# Altium project Breathalyzer_80_Interface.PrjPcb
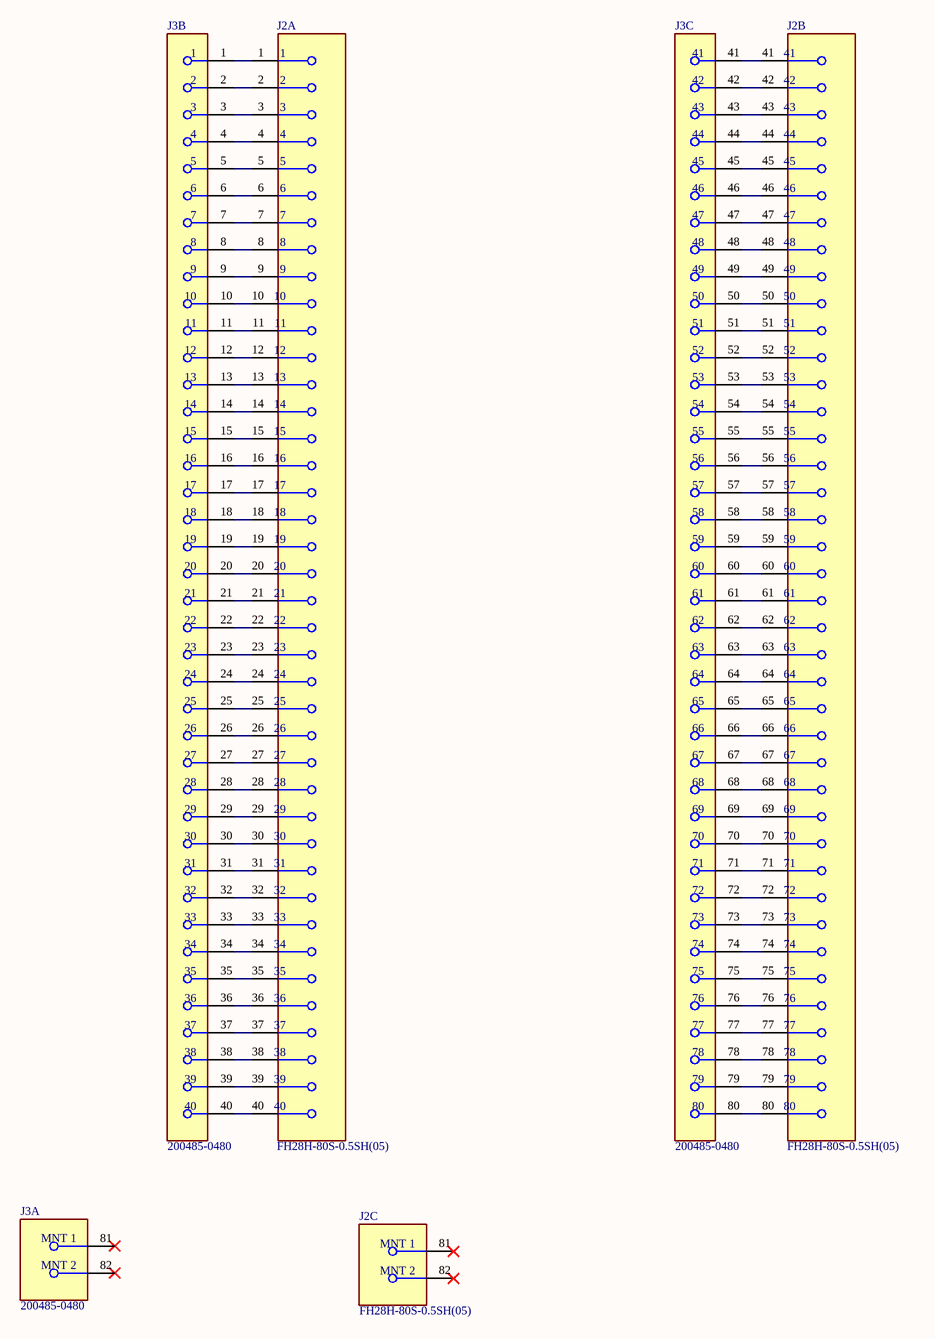
[diagram p0: Sheet1.SchDoc]
CAGE_CODE: ?????; CONTRACT_NUMBER: <CONTRACT NO>; DOC_NO_ASSY_DWG: <ASSY DWG NO>; DOC_NO_BOM: <BOM DOC NO>; DOC_NO_FAB_DWG: <FAB DWG NO>; DOC_NO_SCH_DWG: <SCH DWG NO>; PCB_2_DEC_TOL: +/-.01; PCB_3_DEC_TOL: +/-.010; PCB_ANG_TOL: +/-1/2; PCB_ASSEMBLY_NO: <PCB ASSY NO>; PCB_CHECKER: - -----; PCB_CHECKER_APP_DATE: --/--/----; PCB_DESIGNER: - -----; PCB_DESIGNER_APP_DATE: --/--/----; PCB_DWG_NO: <PCB DWG NO>; PCB_ENGINEER: - -----; PCB_ENGINEER_APP_DATE: --/--/----; PCB_PART_NUMBER: <PCB PN>; PCB_REV: A; SCH_REV: A
1 sheet, 2 parts. Net scope: global (net labels, ports and power ports of the same name join across sheets).
Board file: PCB1.PcbDoc

## Sheet Sheet1.SchDoc
size 431 x 279 mm; SheetNumber: 1; SheetTotal: 1; ENG_APP_DATE: --/--/--; DSN_APP_DATE: --/--/--; CHK_APP_DATE: --/--/--

### Parts
J2  FH28H-80S-0.5SH(05)  [FP-FH28H-80S-0_5SH_05-MFG]  (parts A,B,C of 3)
J3  200485-0480  [FP-200485-0480-MFG]  (parts A,B,C of 3)

### Nets
NetJ2_1: J2.1 J3.1
NetJ2_2: J2.2 J3.2
NetJ2_3: J2.3 J3.3
NetJ2_4: J2.4 J3.4
NetJ2_5: J2.5 J3.5
NetJ2_6: J2.6 J3.6
NetJ2_7: J2.7 J3.7
NetJ2_8: J2.8 J3.8
NetJ2_9: J2.9 J3.9
NetJ2_10: J2.10 J3.10
NetJ2_11: J2.11 J3.11
NetJ2_12: J2.12 J3.12
NetJ2_13: J2.13 J3.13
NetJ2_14: J2.14 J3.14
NetJ2_15: J2.15 J3.15
NetJ2_16: J2.16 J3.16
NetJ2_17: J2.17 J3.17
NetJ2_18: J2.18 J3.18
NetJ2_19: J2.19 J3.19
NetJ2_20: J2.20 J3.20
NetJ2_21: J2.21 J3.21
NetJ2_22: J2.22 J3.22
NetJ2_23: J2.23 J3.23
NetJ2_24: J2.24 J3.24
NetJ2_25: J2.25 J3.25
NetJ2_26: J2.26 J3.26
NetJ2_27: J2.27 J3.27
NetJ2_28: J2.28 J3.28
NetJ2_29: J2.29 J3.29
NetJ2_30: J2.30 J3.30
NetJ2_31: J2.31 J3.31
NetJ2_32: J2.32 J3.32
NetJ2_33: J2.33 J3.33
NetJ2_34: J2.34 J3.34
NetJ2_35: J2.35 J3.35
NetJ2_36: J2.36 J3.36
NetJ2_37: J2.37 J3.37
NetJ2_38: J2.38 J3.38
NetJ2_39: J2.39 J3.39
NetJ2_40: J2.40 J3.40
NetJ2_41: J2.41 J3.41
NetJ2_42: J2.42 J3.42
NetJ2_43: J2.43 J3.43
NetJ2_44: J2.44 J3.44
NetJ2_45: J2.45 J3.45
NetJ2_46: J2.46 J3.46
NetJ2_47: J2.47 J3.47
NetJ2_48: J2.48 J3.48
NetJ2_49: J2.49 J3.49
NetJ2_50: J2.50 J3.50
NetJ2_51: J2.51 J3.51
NetJ2_52: J2.52 J3.52
NetJ2_53: J2.53 J3.53
NetJ2_54: J2.54 J3.54
NetJ2_55: J2.55 J3.55
NetJ2_56: J2.56 J3.56
NetJ2_57: J2.57 J3.57
NetJ2_58: J2.58 J3.58
NetJ2_59: J2.59 J3.59
NetJ2_60: J2.60 J3.60
NetJ2_61: J2.61 J3.61
NetJ2_62: J2.62 J3.62
NetJ2_63: J2.63 J3.63
NetJ2_64: J2.64 J3.64
NetJ2_65: J2.65 J3.65
NetJ2_66: J2.66 J3.66
NetJ2_67: J2.67 J3.67
NetJ2_68: J2.68 J3.68
NetJ2_69: J2.69 J3.69
NetJ2_70: J2.70 J3.70
NetJ2_71: J2.71 J3.71
NetJ2_72: J2.72 J3.72
NetJ2_73: J2.73 J3.73
NetJ2_74: J2.74 J3.74
NetJ2_75: J2.75 J3.75
NetJ2_76: J2.76 J3.76
NetJ2_77: J2.77 J3.77
NetJ2_78: J2.78 J3.78
NetJ2_79: J2.79 J3.79
NetJ2_80: J2.80 J3.80

Not connected (* = marked no-connect by the designer): J2 81(MNT_1)* 82(MNT_2)*; J3 81(MNT_1)* 82(MNT_2)*

### Notes on the sheet
- 8
- 7
- 6
- 5
- 4
- 3
- DWG. NO.
- REV.
- SHT.
- 2
- 1
- THIS DOCUMENT AND THE DATA DISCLOSED HEREIN OR HEREWITH IS THE PROPERTY OF ALTIUM LIMITED AND MAY BE FREELY DISTRIBUTED IN WHOLE. NO RIGHTS ARE RESERVED OR EXPRESS OR IMPLIED WARANTEE GIVEN.
- REVISION
- DESCRIPTION
- DATE
- APPROVED
- F
- E
- D
- C
- B
- ENG:
- APPROVALS
- PROJECT
- SUITE 200
- 2175 SALK AVENUE
- CARLSBAD, CA 92008
- A
- DSN:
- CHK:
- REFERENCE DOCUMENTS
- PROJECT REVISION:
- TITLE
- DOCUMENT REVISION:
- DESIGN ITEM:
- USA
- BOM:
- FAB DWG:
- PCB DWG:
- ASSY DWG:
- SCALE:
- SIZE
- CAGE CODE
- FILE NAME
- DWG NO.
- SHEET
- OF
- REV

### Library data of the parts
J2 = CMP-11609-000031-1: CONN FFC BOTTOM 80POS 0.50MM R/A; Number of Positions: 80; Voltage Rating: 50V; Contact Resistance: 50mR; Max Current Rating: 500mA; Gender: Receptacle; Pitch: 0.5mm; Mating Cycles: 20; Actuator Material: Polymer; Insulation Resistance: 500MR; Contact Plating: Gold; Orientation: Right Angle; Contact Material: Bronze; Number of Rows: 1; Max Operating Temperature: 85°C; Number of Contacts: 80; Flammability Rating: UL94 V-0; Lead Pitch: 0.5mm; Length: 44.9mm; Radiation Hardening: No; Packaging: Tape and Reel; RoHS Compliant: Yes; REACH SVHC: No SVHC; Current Rating: 500mA; Housing Color: Grey; Depth: 6.5mm; Min Operating Temperature: -40°C; Series: FH28; Termination: Solder; Package Quantity: 1; Housing Material: Polymer; Mount: Surface Mount; Max Voltage Rating (AC): 50V
J3 = CMP-04775-000024-1: 0.5 ONE-TOUCH RA 80P